# EAGLE design hrv_monitor_rev1 (EAGLE 4.16)
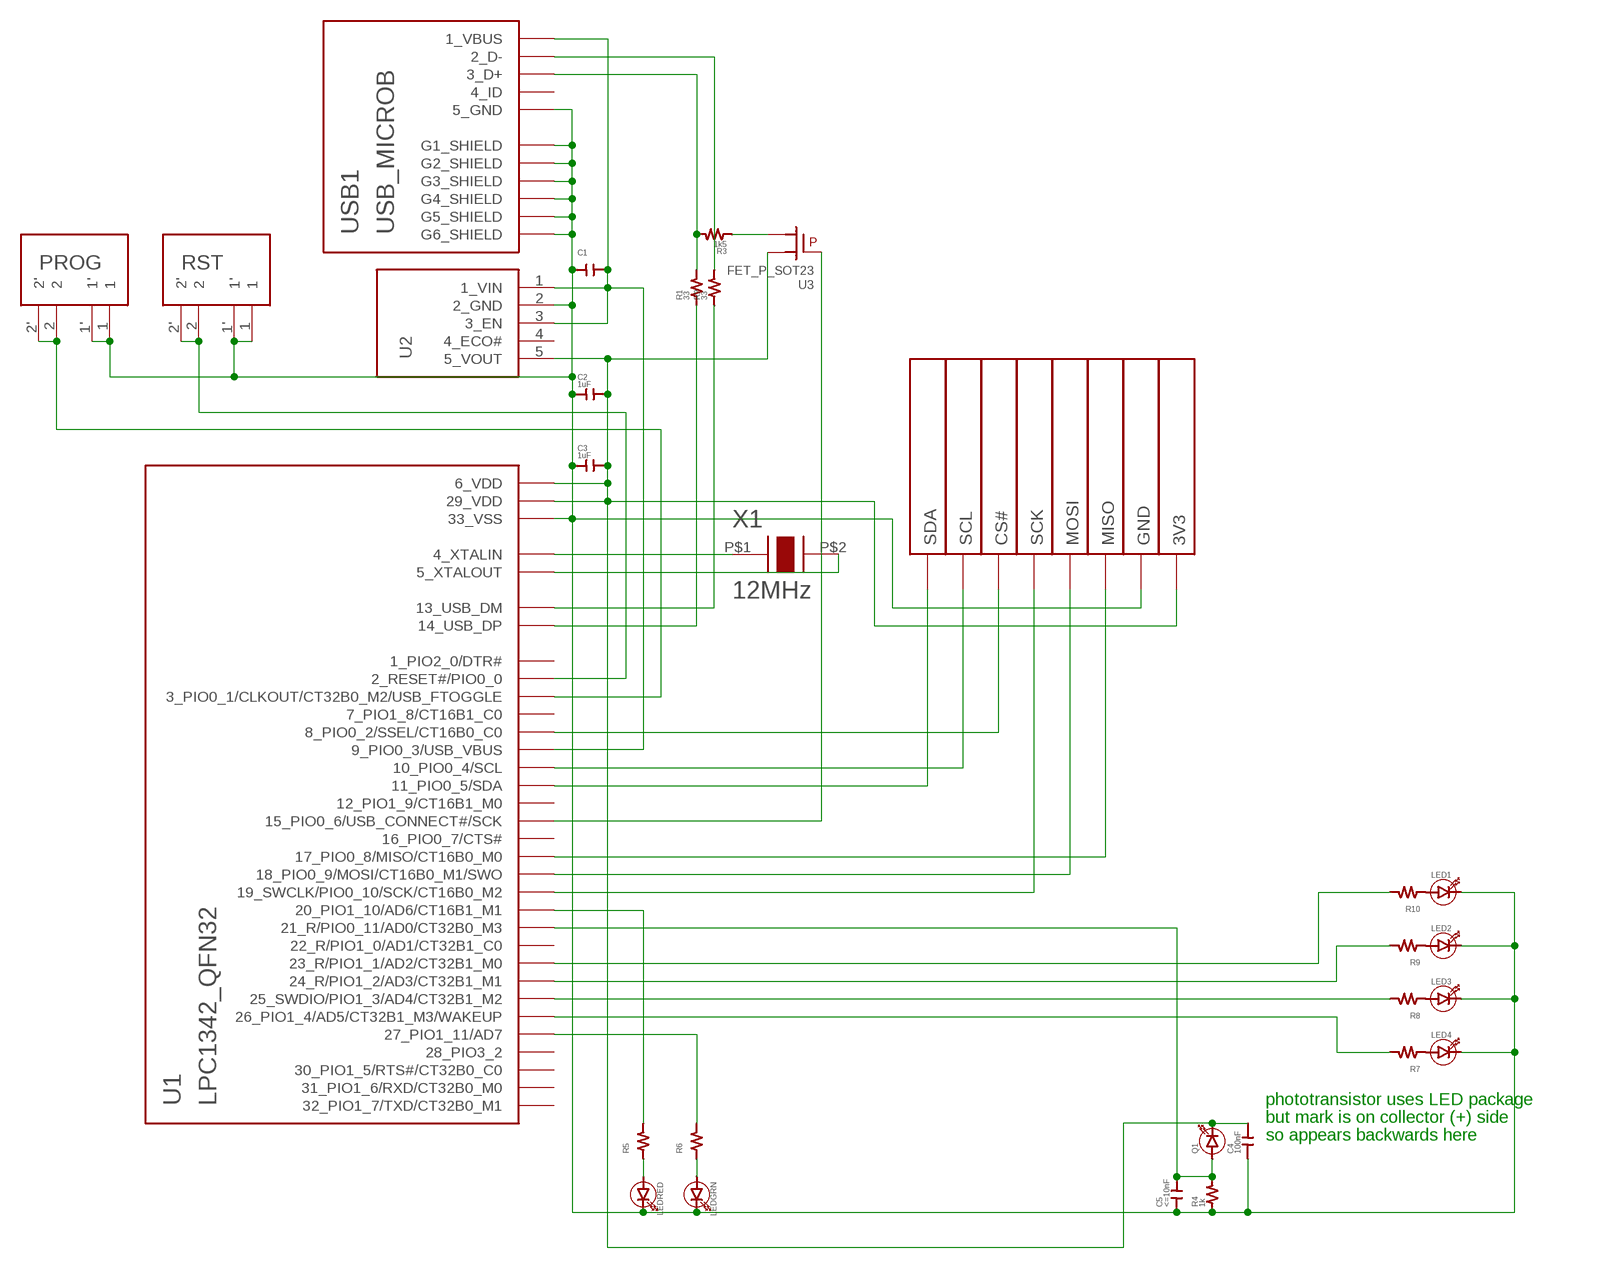
[diagram p0: schematic, sheet 1]

## Parts
3V3  PIN1.2MM  [PIN_1.2MM]
C1  CAP0603  [0603]
C2  1uF  CAP0603  [0603]
C3  1uF  CAP0603  [0603]
C4  100nF  CAP0603  [0603]
C5  <=10nF  CAP0603  [0603]
CS#  PIN1.2MM  [PIN_1.2MM]
GND  PIN1.2MM  [PIN_1.2MM]
LED1  LED0603  [0603_DIODE]
LED2  LED0603  [0603_DIODE]
LED3  LED0603  [0603_DIODE]
LED4  LED0603  [0603_DIODE]
LEDGRN  LED0603  [0603_DIODE]
LEDRED  LED0603  [0603_DIODE]
MISO  PIN1.2MM  [PIN_1.2MM]
MOSI  PIN1.2MM  [PIN_1.2MM]
PROG  SW_SPST4  [SW_EVQ-P7C01K]
Q1  LED0603  [0603_DIODE]
R1  33  RES0603  [0603]
R2  33  RES0603  [0603]
R3  1k5  RES0603  [0603]
R4  1k  RES0603  [0603]
R5  RES0603  [0603]
R6  RES0603  [0603]
R7  RES0603  [0603]
R8  RES0603  [0603]
R9  RES0603  [0603]
R10  RES0603  [0603]
RST  SW_SPST4  [SW_EVQ-P7C01K]
SCK  PIN1.2MM  [PIN_1.2MM]
SCL  PIN1.2MM  [PIN_1.2MM]
SDA  PIN1.2MM  [PIN_1.2MM]
U1  LPC1342_QFN32  [QFN32PAD_.65MM_7X7]
U2  VREG_LDO  [SOT-23-5]
U3  FET_P_SOT23  [SOT-23-3-FET]
USB1  USB_MICROB  [USB_MICROB_FEMALE_FCI_10103594]
X1  12MHz  CRYSTAL5MM_3.2MM  [X_5MM_3.2MM]

## Nets
3V3: 3V3.P$1 C2.2 C3.2 C4.2 Q1.- U1.6(6_VDD) U1.29(29_VDD) U2.5(5_VOUT) U3.S
GND: C1.1 C2.1 C3.1 C4.1 C5.1 GND.P$1 LED1.- LED2.- LED3.- LED4.- LEDGRN.- LEDRED.- PROG.1 PROG.1' R4.1 RST.1 RST.1' U1.33(33_VSS) U2.2(2_GND) USB1.5(5_GND) USB1.G1(G1_SHIELD) USB1.G2(G2_SHIELD) USB1.G3(G3_SHIELD) USB1.G4(G4_SHIELD) USB1.G5(G5_SHIELD) USB1.G6(G6_SHIELD)
N$1: R7.2 U1.26(26_PIO1_4/AD5/CT32B1_M3/WAKEUP)
N$2: C1.2 U1.9(9_PIO0_3/USB_VBUS) U2.1(1_VIN) U2.3(3_EN) USB1.1(1_VBUS)
N$3: R8.2 U1.25(25_SWDIO/PIO1_3/AD4/CT32B1_M2)
N$4: R1.2 R3.2 USB1.3(3_D+)
N$5: R1.1 U1.14(14_USB_DP)
N$6: R2.2 USB1.2(2_D-)
N$7: R2.1 U1.13(13_USB_DM)
N$8: RST.2 RST.2' U1.2(2_RESET#/PIO0_0)
N$9: PROG.2 PROG.2' U1.3(3_PIO0_1/CLKOUT/CT32B0_M2/USB_FTOGGLE)
N$10: U1.4(4_XTALIN) X1.P$1
N$11: U1.5(5_XTALOUT) X1.P$2
N$12: R3.1 U3.D
N$13: U1.15(15_PIO0_6/USB_CONNECT#/SCK) U3.G
N$14: SCL.P$1 U1.10(10_PIO0_4/SCL)
N$15: SDA.P$1 U1.11(11_PIO0_5/SDA)
N$16: MOSI.P$1 U1.18(18_PIO0_9/MOSI/CT16B0_M1/SWO)
N$17: MISO.P$1 U1.17(17_PIO0_8/MISO/CT16B0_M0)
N$18: SCK.P$1 U1.19(19_SWCLK/PIO0_10/SCK/CT16B0_M2)
N$19: CS#.P$1 U1.8(8_PIO0_2/SSEL/CT16B0_C0)
N$20: LED1.+ R10.1
N$21: LED2.+ R9.1
N$22: LED3.+ R8.1
N$23: LED4.+ R7.1
N$24: C5.2 Q1.+ R4.2 U1.21(21_R/PIO0_11/AD0/CT32B0_M3)
N$25: R9.2 U1.24(24_R/PIO1_2/AD3/CT32B1_M1)
N$26: R10.2 U1.23(23_R/PIO1_1/AD2/CT32B1_M0)
N$27: R5.2 U1.20(20_PIO1_10/AD6/CT16B1_M1)
N$28: LEDRED.+ R5.1
N$29: R6.2 U1.27(27_PIO1_11/AD7)
N$30: LEDGRN.+ R6.1
Unconnected: U1.1(1_PIO2_0/DTR#) U1.7(7_PIO1_8/CT16B1_C0) U1.12(12_PIO1_9/CT16B1_M0) U1.16(16_PIO0_7/CTS#) U1.22(22_R/PIO1_0/AD1/CT32B1_C0) U1.28(28_PIO3_2) U1.30(30_PIO1_5/RTS#/CT32B0_C0) U1.31(31_PIO1_6/RXD/CT32B0_M0) U1.32(32_PIO1_7/TXD/CT32B0_M1) U2.4(4_ECO#) USB1.4(4_ID)

## Notes on the sheet
- phototransistor uses LED package
- but mark is on collector (+) side
- so appears backwards here

## Library data of the parts
3V3 CS# GND MISO MOSI SCK SCL SDA = _sg_lib:PIN
C1-C5 = _sg_lib:CAP0603
LED1-LED4 LEDGRN LEDRED Q1 = _sg_lib:LED0603
PROG RST = _sg_lib:SW_SPST4
R1-R10 = _sg_lib:RES0603
U1 = _sg_lib:LPC1342_QFN32
U2 = _sg_lib:VREG_LDO
U3 = _sg_lib:FET_P_SOT23
USB1 = _sg_lib:USB_MICROB
X1 = _sg_misc:CRYSTAL

## Board
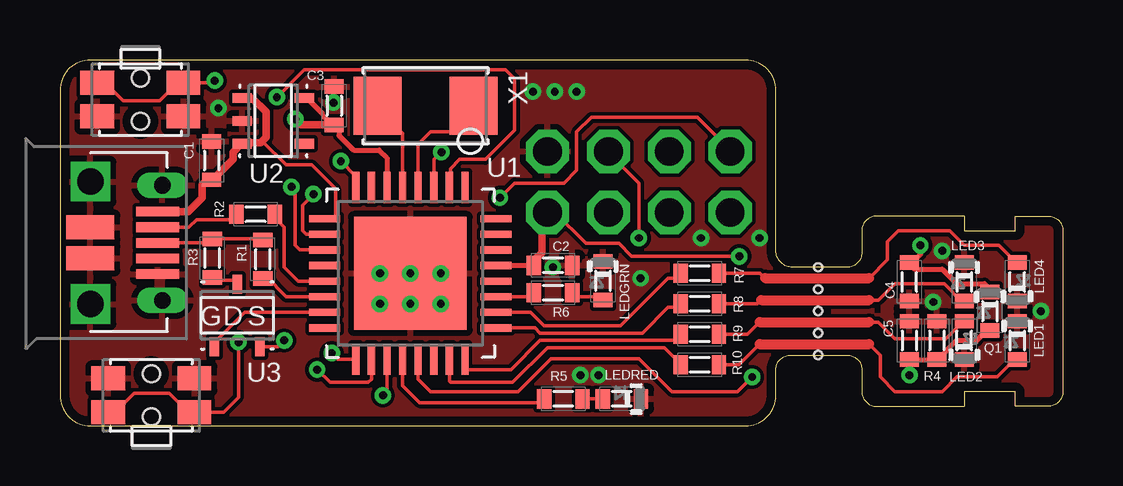
[diagram p1: board, top side]
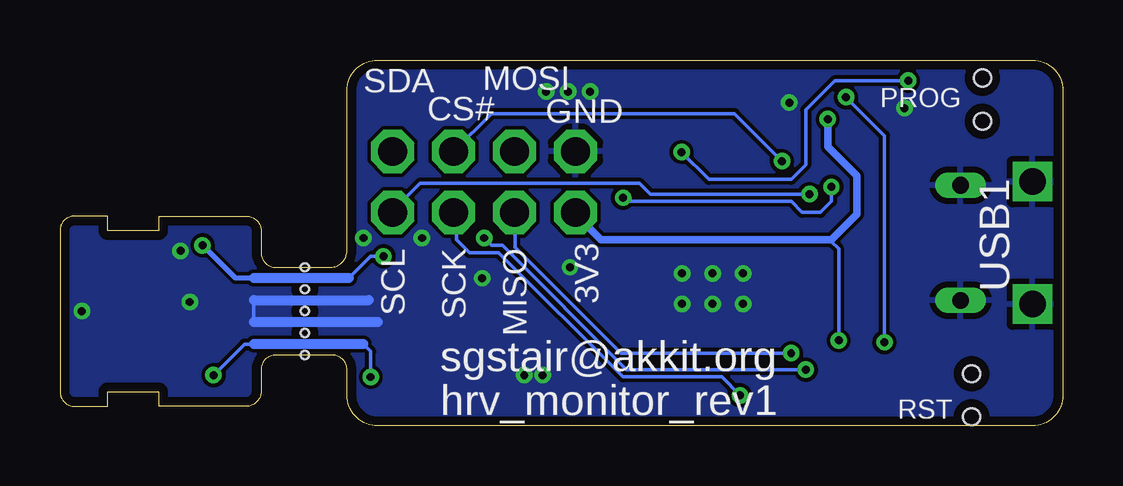
[diagram p2: board, bottom side, seen from below]

Size 41.81 x 15.24 mm. Coordinates in mm from the lower left corner, seen from the top.
Outline: 29.84,13.97 arc90 28.58,15.24 1.27,15.24 arc90 0,13.97 0,1.27 arc90 1.27,0 28.58,0 arc90 29.84,1.27 29.84,2.34 arc-90 30.45,2.95 32.82,2.95 arc-90 33.43,2.34 33.43,1.42 arc90 34.04,0.81 37.69,0.81 37.69,1.42 39.83,1.42 39.83,0.81 41.19,0.81 arc90 41.81,1.43 41.81,8.13 arc90 41.2,8.74 39.83,8.74 39.83,8.13 37.69,8.13 37.69,8.74 34.04,8.74 arc90 33.43,8.13 33.43,7.21 arc-90 32.82,6.6 30.53,6.6 arc-90 29.84,7.29 29.84,13.97
Copper layers (1*16): Top 0.0356mm / dielectric 1.5011mm / Bottom 0.0356mm
Design rules "LaenPCBOrder": minimum track width 6mil, minimum drill 13mil, track to track 6mil, track to pad 6mil, pad to pad 6mil, via to via 6mil, smd to smd 6mil, copper to edge 15mil, drill to drill 6mil, minimum pad ring 7mil, minimum via ring 7mil, stop-mask expansion 4mil, vias tented up to drill 25mil, thermal gap 10mil
Holes 0.33 mm at 31.6,2.95 31.6,3.86 31.6,4.78 31.6,5.69 31.6,6.6
tRestrict: area 34,4.7 to 34.2,4.9

### Footprints (pad centres in the part's own frame; a part is rotated, then mirrored left to right if it is on the bottom)
PIN_1.2MM = drill 1.2 octagon: P$1 0,0
0603 = smd 0.6 x 0.8: 1 -0.8,0; 2 0.8,0
0603_DIODE = smd 0.6 x 0.8: + 0.8,0; - -0.8,0
SW_EVQ-P7C01K = smd 1.4 x 1: 1 -1.8,0.7; 1' 1.8,0.7; 2 -1.8,-0.7; 2' 1.8,-0.7 | hole 0.7: 0,0.9; 0,-0.9
QFN32PAD_.65MM_7X7 = smd 1.3 x 0.3: 1 -3.575,2.275; 2 -3.575,1.625; 3 -3.575,0.975; 4 -3.575,0.325; 5 -3.575,-0.325; 6 -3.575,-0.975; 7 -3.575,-1.625; 8 -3.575,-2.275; 17 3.575,-2.275; 18 3.575,-1.625; 19 3.575,-0.975; 20 3.575,-0.325; 21 3.575,0.325; 22 3.575,0.975; 23 3.575,1.625; 24 3.575,2.275 | smd 0.3 x 1.3: 9 -2.275,-3.575; 10 -1.625,-3.575; 11 -0.975,-3.575; 12 -0.325,-3.575; 13 0.325,-3.575; 14 0.975,-3.575; 15 1.625,-3.575; 16 2.275,-3.575; 25 2.275,3.575; 26 1.625,3.575; 27 0.975,3.575; 28 0.325,3.575; 29 -0.325,3.575; 30 -0.975,3.575; 31 -1.625,3.575; 32 -2.275,3.575 | smd 4.7 x 4.7: 33 0,0
SOT-23-5 = smd 0.8 x 0.4: 1 -1.3,0.95; 2 -1.3,0; 3 -1.3,-0.95; 4 1.3,-0.95; 5 1.3,0.95
SOT-23-3-FET = smd 0.8 x 0.4: D 1.3,0; G -1.3,0.95; S -1.3,-0.95
USB_MICROB_FEMALE_FCI_10103594 = smd 0.4 x 1.8: 1 -1.3,2.8; 2 -0.65,2.8; 3 0,2.8; 4 0.65,2.8; 5 1.3,2.8 | drill 0.7 long: G1 -2.4,3; G2 2.4,3 | smd 1 x 2: G3 -0.65,0; G4 0.65,0 | drill 1.1 square: G5 -2.55,0; G6 2.55,0
X_5MM_3.2MM = smd 2 x 2.4: P$1 -2,0; P$2 2,0

### Placement (x,y rotation side)
3V3  20.32,8.89 0 bottom
C1  6.32,11.05 270 top
C2  20.55,6.68 180 top
C3  11.43,13.34 270 top
C4  35.41,5.99 90 top
C5  35.41,3.56 270 top
CS#  25.4,11.43 90 bottom
GND  20.32,11.43 0 bottom
LED1  39.9,3.56 270 top
LED2  37.69,3.56 90 top
LED3  37.69,5.99 270 top
LED4  39.9,5.99 90 top
LEDGRN  22.63,6.05 270 top
LEDRED  23.42,1.12 180 top
MISO  22.86,8.89 270 bottom
MOSI  22.86,11.43 90 bottom
PROG  3.35,13.59 180 top
Q1  38.76,4.78 270 top
R1  8.46,6.93 90 top
R2  8.15,8.81 180 top
R3  6.35,6.98 90 top
R4  36.55,3.56 270 top
R5  20.98,1.12 180 top
R6  20.55,5.54 180 top
R7  26.67,6.35 180 top
R8  26.67,5.08 180 top
R9  26.67,3.81 180 top
R10  26.67,2.54 180 top
RST  3.81,1.27 0 top
SCK  25.4,8.89 270 bottom
SCL  27.94,8.89 270 bottom
SDA  27.94,11.43 90 bottom
U1  14.61,6.35 270 top
U2  8.89,12.7 0 top
U3  7.39,4.6 90 top
USB1  1.27,7.62 270 top
X1  15.24,13.34 180 top

### Tracks (layer width: path | path; a pad name or v marks a point on that pad's centre or on a via)
3V3  (via drill 0.33)
  Top 0.152: U3.S 9.09,3.3 v9.35,3.56 | 20.24,8.89 20.62,8.89 21.92,7.59 23.29,7.59 23.83,7.06 v28.32,7.06
  Top 0.203: U1.6 13.63,11.16 13.31,11.48 12.24,11.48 11.63,12.09 11.63,12.55 11.62,12.54 C3.2 11.34,12.54 11.02,12.85 10.95,13.01 10.3,13.65 U2.5 | 19.79,6.76 19.75,6.72 | 19.75,6.72 C2.2 | U1.29 19.7,6.68 19.75,6.72 | v35.87,7.52 35.87,7.14 35.52,6.79 C4.2 35.41,6.76 35.64,6.53 36.78,6.53 37.39,5.92 38.53,5.92 38.76,5.69 Q1.-
  Top 0.305: C3.2 10.05,12.54 v9.8,12.78 | 19.79,6.76 19.79,6.91 20.09,7.21 20.09,8.74 20.24,8.89 20.32,8.97 3V3.P$1
  Bottom 0.152: 9.65,7.75 9.65,7.67 9.35,7.37 v9.35,3.56 | v28.32,7.06 28.85,7.06 29.77,6.15
  Bottom 0.203: 33.73,6.15 34.49,6.15 v35.87,7.52
  Bottom 0.305: v9.8,12.78 9.8,11.63 8.59,10.41 8.59,8.81 9.65,7.75 19.25,7.75 20.4,8.89 3V3.P$1
  Bottom 0.406: 29.77,6.15 33.73,6.15
GND  (via drill 0.33)
  Bottom 0.152: v29.16,7.82 28.93,7.82 | 33.73,4.32 33.73,5.23
  Bottom 0.406: 33.73,5.23 28.93,5.23 | 28.55,4.32 33.73,4.32
  other vias: 13.34,6.35 14.61,6.35 15.88,6.35 15.88,5.08 14.61,5.08 13.34,5.08 11.4,13.46 6.6,13.23 20.55,6.6 26.72,7.82 24.21,6.15 19.71,13.92 20.62,13.92 21.54,13.92 21.69,2.11 22.45,2.11 36.4,5.16 36.78,7.29 40.89,4.78
  pour Top: -1.17,16.89 34.95,16.89 43.26,8.59 43.26,-0.03 40.74,-2.54 1.96,-2.54 -3.15,2.57
  pour Bottom: -1.17,17.65 43.26,17.65 43.26,-1.32 -3.15,-1.32 -3.15,16.81
N$1
  Top 0.152: U1.26 19.61,4.73 20.17,4.17 23.37,4.17 25.35,6.15 25.81,6.15 25.87,6.21 R7.2
N$2
  Top 0.152: U1.9 11.44,8.62 11.48,8.66 11.48,9.88 10.49,10.87 9.42,10.87 8.43,11.86
  Top 0.305: USB1.1 5.34,8.92 5.92,9.5 5.92,10.03 6.22,10.34 C1.2 6.36,10.25 7.21,11.1 7.21,11.41 7.56,11.75 U2.3 7.59,11.71 7.67,11.79 8.36,11.79 8.43,11.86 8.59,12.01 8.59,13.08 8.02,13.65 U2.1
N$3
  Top 0.152: U1.25 19.8,4.08 20.02,3.86 24.28,3.86 25.35,4.93 25.81,4.93 25.88,5 25.87,5.02 R8.2
N$4
  Top 0.152: USB1.3 6.17,7.62 6.34,7.79 R3.2 8.55,7.79 8.59,7.75 8.57,7.73 R1.2
N$5
  Top 0.152: R1.1 8.5,6.13 8.59,6.22 9.43,5.38 U1.14
N$6
  Top 0.152: USB1.2 5.37,8.27 5.69,8.59 7.37,8.59 7.44,8.66 7.35,8.75 R2.2
N$7
  Top 0.152: U1.13 9.93,6.03 9.35,6.6 9.35,8.28 8.89,8.74 R2.1
N$8  (via drill 0.33)
  Top 0.152: RST.2' 5.68,0.57 5.69,0.58 | RST.2' 6.82,0.57 7.44,1.19 v7.44,3.48 | v9.04,13.69 10.19,14.83 18.57,14.83 18.95,14.45 18.95,12.32 17.73,11.1 16.66,11.1 16.28,10.72 16.28,10.03 16.2,9.96 U1.2 | RST.2 2.32,0.57 3.1,1.35 4.55,1.35 5.46,0.43 5.6,0.57 RST.2'
  Bottom 0.152: v7.44,3.48 7.44,12.09 v9.04,13.69
N$9  (via drill 0.33)
  Top 0.152: PROG.2 5.37,14.29 5.39,14.3 | PROG.2 6.36,14.29 v6.45,14.38 | v15.9,11.41 15.6,11.1 15.6,9.88 15.58,9.9 U1.3 | PROG.2' 1.89,14.29 2.64,13.54 4.17,13.54 5.08,14.45 5.15,14.38 PROG.2
  Bottom 0.152: v6.45,14.38 9.5,14.38 10.72,13.16 10.72,10.87 11.33,10.26 14.76,10.26 v15.9,11.41
N$10
  Top 0.152: U1.4 14.93,11.73 15.44,12.24 16.36,12.24 17.24,13.12 X1.P$1
N$11
  Top 0.152: X1.P$2 13.24,13.23 14.28,12.19 U1.5
N$12
  Top 0.152: R3.1 6.57,6.19 6.68,6.07 7.21,6.07 U3.D
N$13
  Top 0.152: U3.G 6.44,3.47 7.7,4.73 U1.15
N$14  (via drill 0.33)
  Top 0.152: U1.10 10.26,7.98 10.11,8.13 10.11,9.2 v10.57,9.65
  Bottom 0.152: v10.57,9.65 17.2,9.65 17.65,10.11 26.8,10.11 28.02,8.89 SCL.P$1
N$15  (via drill 0.33)
  Top 0.152: U1.11 10,7.33 9.8,7.52 9.8,9.8 v9.65,9.96 | v18.34,9.5 18.95,10.11 21.01,10.11 21.54,10.64 21.54,12.24 22.15,12.85 26.57,12.85 27.94,11.48 SDA.P$1
  Bottom 0.152: v9.65,9.96 9.65,9.35 10.11,8.89 10.87,8.89 11.33,9.35 18.19,9.35 v18.34,9.5
N$16  (via drill 0.33)
  Top 0.152: U1.18 12.98,1.93 12.85,1.8 11.25,1.8 v10.72,2.34 | MOSI.P$1 22.84,11.41 24.13,10.11 v24.13,7.82
  Bottom 0.152: v10.72,2.34 18.19,2.34 23.37,7.52 23.83,7.52 v24.13,7.82
N$17  (via drill 0.33)
  Top 0.152: U1.17 11.58,2.78 v11.33,3.02
  Bottom 0.152: v11.33,3.02 18.41,3.02 22.84,7.44 22.84,8.89 22.86,8.91 | 22.86,8.91 22.91,8.97 | MISO.P$1 22.91,8.89 22.88,8.91 22.86,8.91
N$18  (via drill 0.33)
  Top 0.152: U1.19 13.63,1.44 v13.46,1.27
  Bottom 0.152: v13.46,1.27 14.22,2.03 18.34,2.03 23.52,7.21 24.74,7.21 25.27,7.75 25.27,8.89 25.35,8.97 25.4,8.91 SCK.P$1
N$19  (via drill 0.33)
  Top 0.152: U1.8 12.33,10.4 v11.71,11.02
  Bottom 0.152: v11.71,11.02 13.69,13.01 23.83,13.01 CS#.P$1 25.43,11.41
N$20
  Top 0.152: R10.1 28.3,2.54 29.16,3.4 | 33.73,3.4 34.19,2.95 34.19,2.03 34.8,1.42 36.78,1.42 37.39,2.03 39.07,2.03 39.83,2.79 39.87,2.76 LED1.+
  Top 0.406: 29.16,3.4 33.73,3.4
N$21
  Top 0.152: R9.1 28.65,3.81 29.16,4.32 | 33.73,4.32 34.11,4.32 34.8,3.63 36.93,3.63 37.69,4.39 LED2.+
  Top 0.406: 29.16,4.32 33.73,4.32
N$22
  Top 0.152: R8.1 29.08,5.08 29.23,5.23 | 33.73,5.23 34.11,5.23 34.8,5.92 36.86,5.92 37.62,5.16 37.66,5.19 LED3.+
  Top 0.406: 29.23,5.23 33.73,5.23
N$23
  Top 0.152: R7.1 29.19,6.35 29.39,6.15 | 33.73,6.15 34.49,6.91 34.49,7.67 34.95,8.13 37.08,8.13 37.69,7.52 39.14,7.52 39.9,6.76 LED4.+
  Top 0.406: 29.39,6.15 33.73,6.15
N$24  (via drill 0.33)
  Top 0.152: U1.21 14.93,1.94 15.44,1.42 19.1,1.42 20.47,2.79 24.13,2.79 25.5,1.42 28.25,1.42 v28.85,2.03 | v35.41,2.11 C5.2
  Top 0.203: 36.63,2.79 R4.2 | C5.2 36.51,2.76 36.63,2.79 | 36.63,2.79 37.39,3.56 38.23,3.56 38.68,4.01 38.72,3.98 Q1.+
  Bottom 0.152: v28.85,2.03 28.85,3.1 29.16,3.4 | 33.73,3.4 34.11,3.4 v35.41,2.11
  Bottom 0.406: 29.16,3.4 33.73,3.4
N$25
  Top 0.152: U1.24 16.88,2.35 16.89,2.34 18.8,2.34 20.02,3.56 25.73,3.56 25.88,3.71 25.87,3.72 R9.2
N$26
  Top 0.152: U1.23 16.23,1.86 16.28,1.8 18.87,1.8 20.32,3.25 25.2,3.25 25.87,2.58 R10.2
N$27
  Top 0.152: U1.20 14.28,1.67 14.99,0.96 20.02,0.96 20.17,1.12 R5.2
N$28
  Top 0.152: LEDRED.+ R5.1
N$29
  Top 0.152: R6.2 19.75,5.5 19.79,5.46 19.7,5.38 U1.27
N$30
  Top 0.152: LEDGRN.+ 22.59,5.25 22.45,5.39 21.54,5.39 21.39,5.54 R6.1

### Text on the board
bPlace: sgstair@akkit.org | hrv_monitor_rev1